# EAGLE design current_sensor (EAGLE 8.3.2)
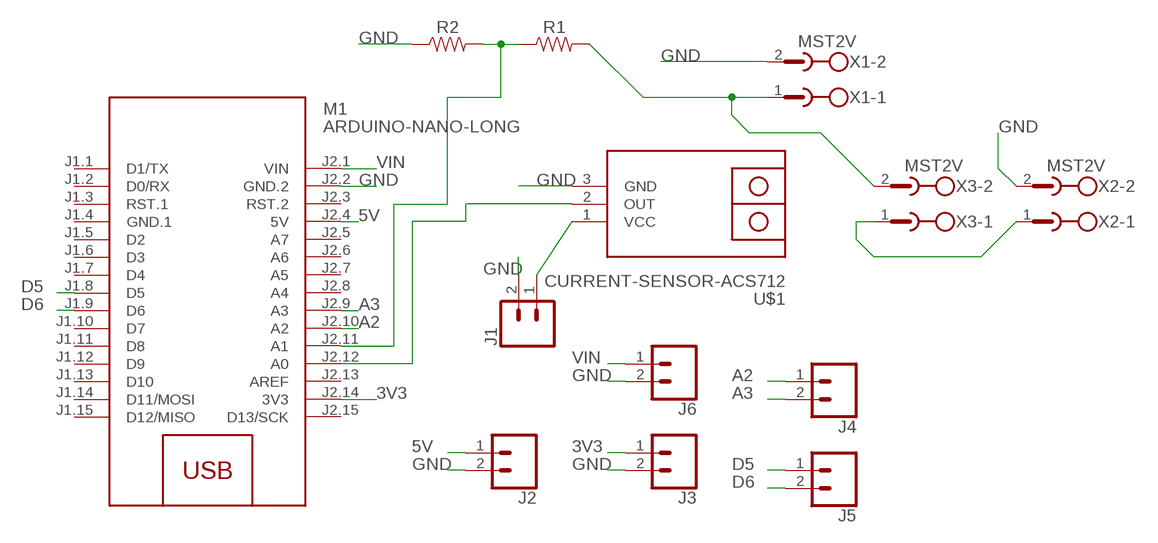
[diagram p0: schematic, sheet 1]

## Parts
J1  CONN_02LOCK_LONGPADS  [1X02_LOCK_LONGPADS]
J2  CONN_02LOCK_LONGPADS  [1X02_LOCK_LONGPADS]
J3  CONN_02LOCK_LONGPADS  [1X02_LOCK_LONGPADS]
J4  CONN_02LOCK_LONGPADS  [1X02_LOCK_LONGPADS]
J5  CONN_02LOCK_LONGPADS  [1X02_LOCK_LONGPADS]
J6  CONN_02LOCK_LONGPADS  [1X02_LOCK_LONGPADS]
M1  ARDUINO-NANO-LONG  [ARDUINO-NANO-LONG]
R1  RESISTORAXIAL-0.3  [AXIAL-0.3]
R2  RESISTORAXIAL-0.3  [AXIAL-0.3]
U$1  CURRENT-SENSOR-ACS712  [CURRENT-SENSOR-ACS712]
X1  MST2V  [MSTBV2]
X2  MST2V  [MSTBV2]
X3  MST2V  [MSTBV2]

## Nets
3V3: J3.1 M1.J2.14(3V3)
5V: J2.1 M1.J2.4(5V)
A2: J4.1 M1.J2.10(A2)
A3: J4.2 M1.J2.9(A3)
D5: J5.1 M1.J1.8(D5)
D6: J5.2 M1.J1.9(D6)
GND: J1.2 J2.2 J3.2 J6.2 M1.J2.2(GND.2) R2.P$1 U$1.3(GND) X1.2 X2.2
N$1: M1.J2.12(A0) U$1.2(OUT)
N$2: R1.P$2 X1.1 X3.2
N$3: J1.1 U$1.1(VCC)
N$5: M1.J2.11(A1) R1.P$1 R2.P$2
N$6: X2.1 X3.1
VIN: J6.1 M1.J2.1(VIN)
Unconnected: M1.J1.1(D1/TX) M1.J1.2(D0/RX) M1.J1.3(RST.1) M1.J1.5(D2) M1.J1.6(D3) M1.J1.7(D4) M1.J1.10(D7) M1.J1.11(D8) M1.J1.12(D9) M1.J1.13(D10) M1.J1.14(D11/MOSI) M1.J1.15(D12/MISO) M1.J2.3(RST.2) M1.J2.5(A7) M1.J2.6(A6) M1.J2.7(A5) M1.J2.8(A4) M1.J2.13(AREF) M1.J2.15(D13/SCK)

## Power pins joined to a net without a drawn wire
GND.1: M1.J1.4(GND.1)

## Library data of the parts
J1-J6 = SparkFun-Connectors:CONN_02: Multi connection point. Often used as Generic Header-pin footprint for 0.1 inch spaced/style header connections On any of the 0.1 inch spaced packages, you can populate with these: Break Away Headers - Straight <https://www.sparkfun.com/products/116> (PRT-00116) Break Away Male Headers - Right Angle <https://www.sparkfun.com/products/553> (PRT-00553) Female Headers <https://www.sparkfun.com/products/115> (PRT-00115) Break Away Headers - Machine Pin <https://www.sparkfun.com/products/117> (PRT-00117) Break Away Female Headers - Swiss Machine Pin <https://www.sparkfun.com/products/743> (PRT-00743) For SCREWTERMINALS and SPRING TERMINALS visit here: Screw Terimnals on SparkFun.com <https://www.sparkfun.com/search/results?term=Screw+Terminals> (5mm/3.5mm/2.54mm spacing) This device is also useful as a general connection point to wire up your design to another part of your project. Our various solder wires solder well into these plated through hole pads. Hook-Up Wire - Assortment (Stranded, 22 AWG) <https://www.sparkfun.com/products/11375> (PRT-11375) Hook-Up Wire - Assortment (Solid Core, 22 AWG) <https://www.sparkfun.com/products/11367> (PRT-11367) View the entire wire category on our website here <https://www.sparkfun.com/categories/141> Special notes: Molex polarized connector foot print use with: PRT-08233 with associated crimp pins and housings. 2.54_SCREWTERM for use with PRT-10571. 3.5mm Screw Terminal footprints for PRT-08084 5mm Screw Terminal footprints for use with PRT-08432
M1 = ArduinoNano:ARDUINO-NANO-LONG: Arduino Nano 3.0 and compatible devices More details available here: https://www.arduino.cc/en/Main/ArduinoBoardNano Click here to find device on ebay.com <http://www.ebay.com/sch/arduino+nano>
R1 R2 = SparkFun-Resistors:RESISTOR: Generic Resistor Package
U$1 = diy-modules:CURRENT-SENSOR-ACS712: Isolated Bipolar Current Sensors based on ACS712 chip More details available here: http://embedded-lab.com/blog/a-brief-overview-of-allegro-acs712-current-sensor-part-1/ Click here to find device on ebay.com <http://www.ebay.com/sch/acs712+module> Note: There are many available versions with different pinout. Please check before use
X1-X3 = con-phoenix-508:MST2V: PHOENIX; OC_FARNELL: unknown; OC_NEWARK: unknown

## Board
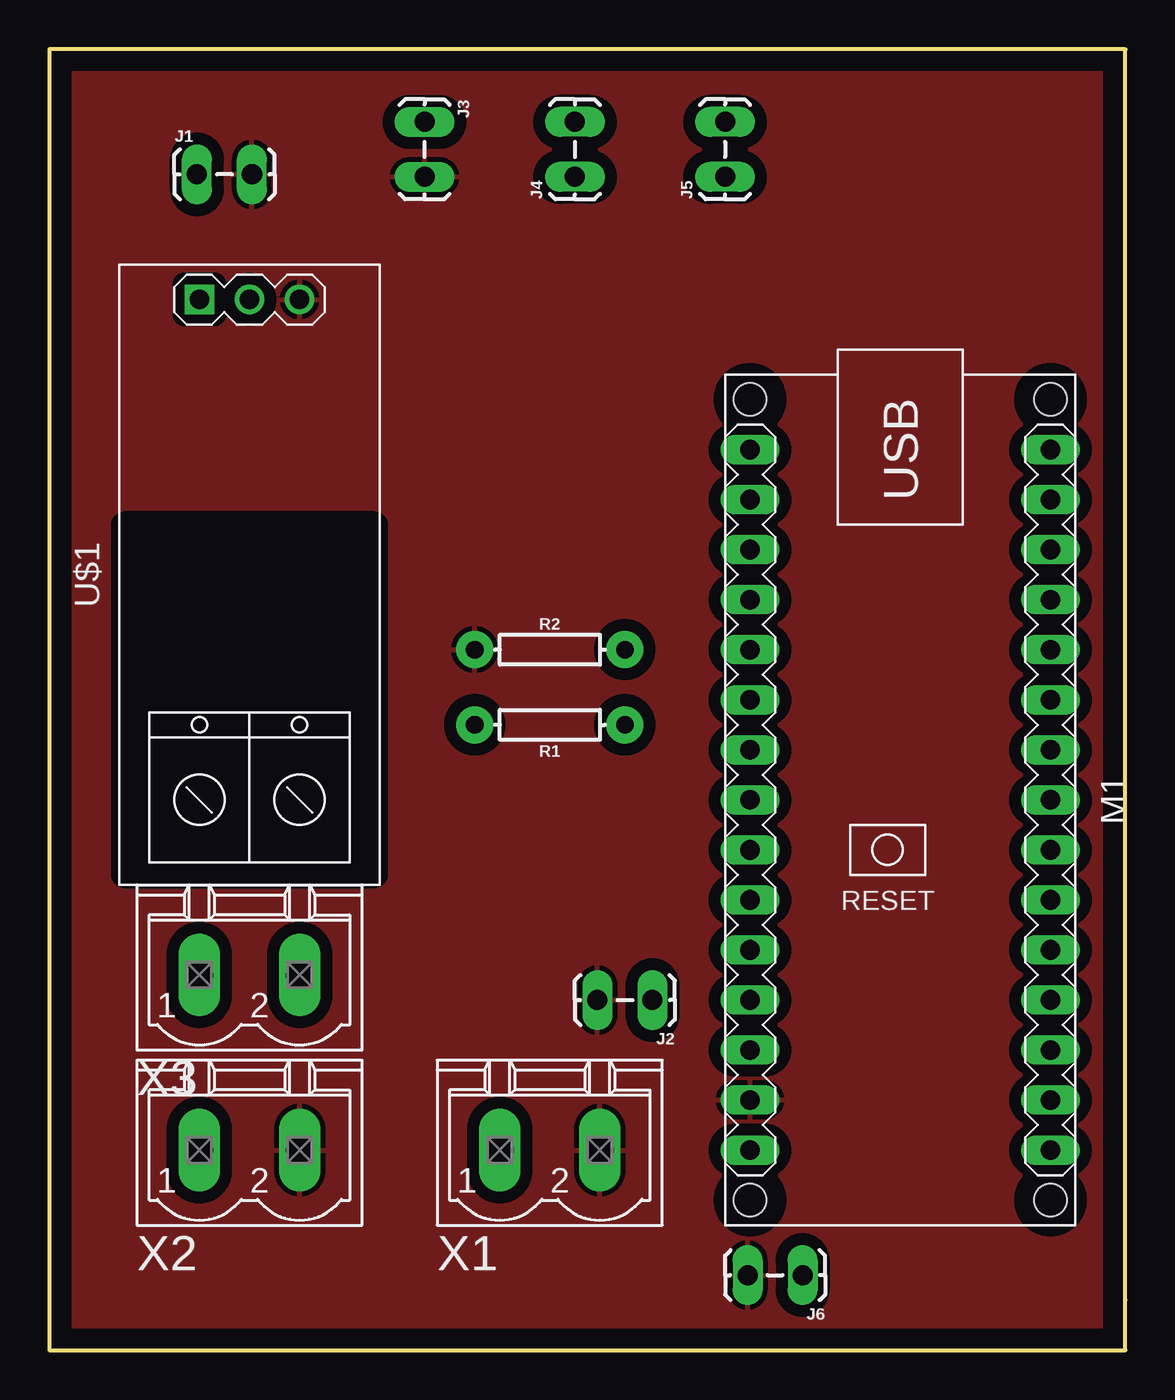
[diagram p1: board, top side]
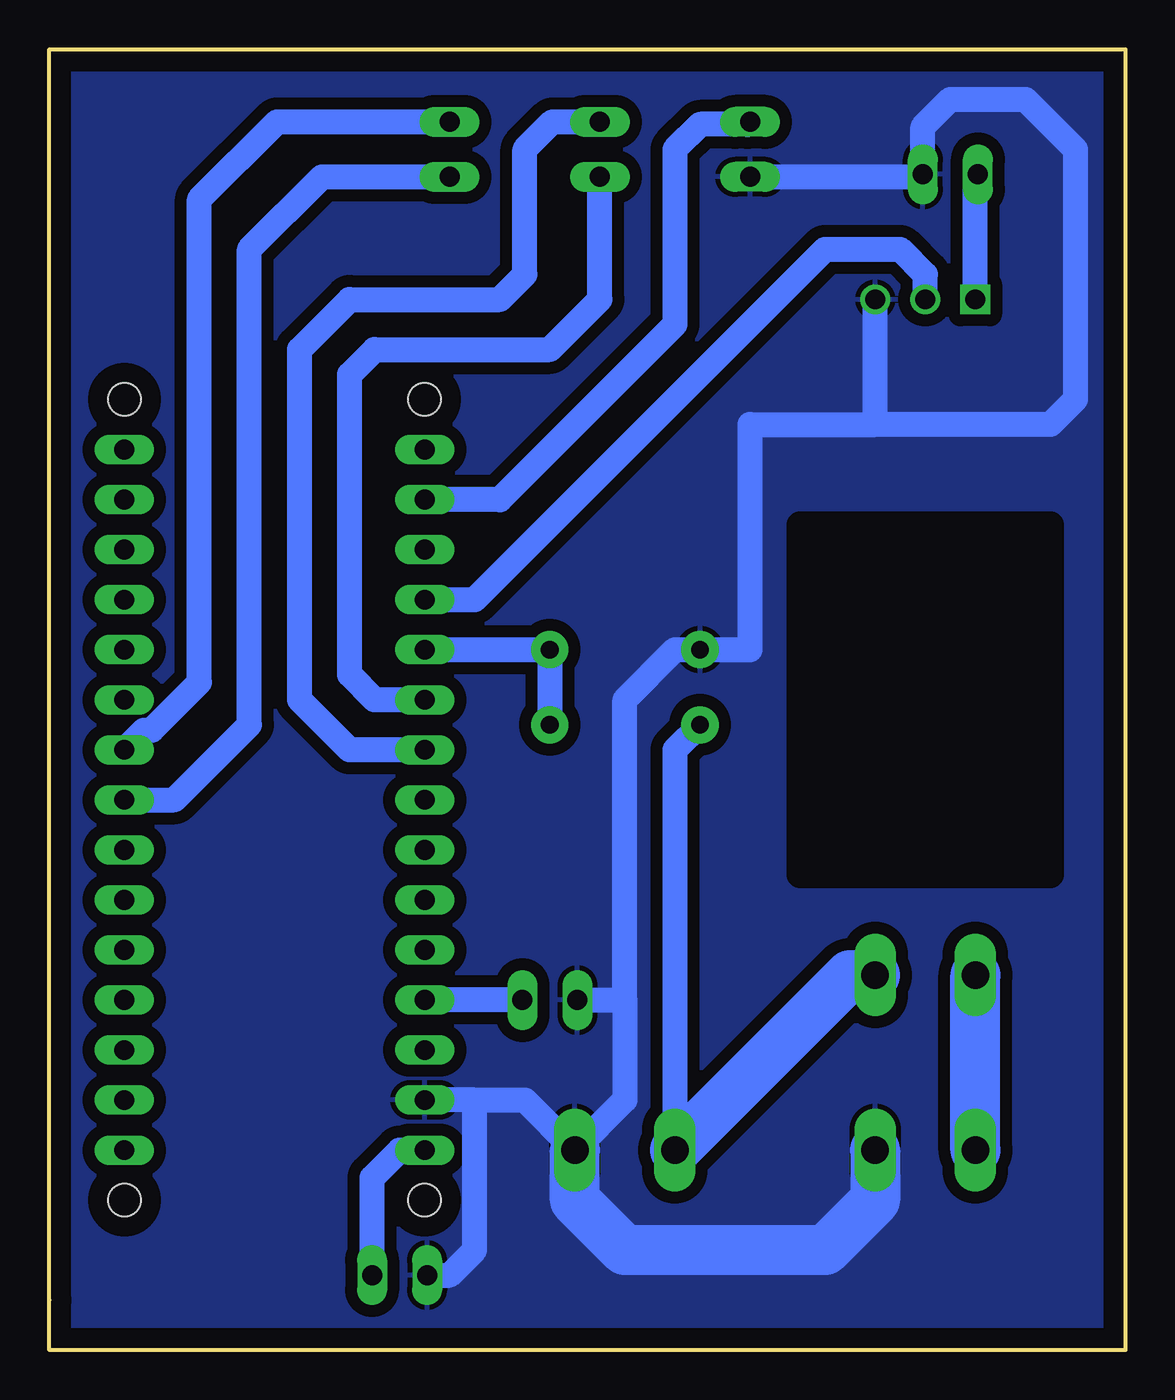
[diagram p2: board, bottom side, seen from below]

Size 54.61 x 66.04 mm. Coordinates in mm from the lower left corner, seen from the top.
Outline: 54.61,2.54 54.61,66.04 0,66.04 0,2.54 0,0 54.61,0 54.61,2.54
Copper layers (1*16): Top 0.035mm / dielectric 1.5mm / Bottom 0.035mm
Design rules "default *": minimum track width 6mil, minimum drill 0.9mm, track to track 6mil, track to pad 6mil, pad to pad 6mil, via to via 6mil, smd to smd 6mil, copper to edge 40mil, drill to drill 6mil, minimum pad ring 10mil, minimum via ring 8mil, stop-mask expansion 4mil, vias tented up to drill 0mil, thermal gap 10mil
tRestrict: area 3.8,24.1 to 16.5,41.9
bRestrict: area 3.8,24.1 to 16.5,41.9

### Footprints (pad centres in the part's own frame; a part is rotated, then mirrored left to right if it is on the bottom)
1X02_LOCK_LONGPADS = drill 1.016 long: 1 -0.127,0; 2 2.667,0
ARDUINO-NANO-LONG = drill 1 long: J1.1 17.78,7.62; J1.2 15.24,7.62; J1.3 12.7,7.62; J1.4 10.16,7.62; J1.5 7.62,7.62; J1.6 5.08,7.62; J1.7 2.54,7.62; J1.8 0,7.62; J1.9 -2.54,7.62; J1.10 -5.08,7.62; J1.11 -7.62,7.62; J1.12 -10.16,7.62; J1.13 -12.7,7.62; J1.14 -15.24,7.62; J1.15 -17.78,7.62; J2.1 17.78,-7.62; J2.2 15.24,-7.62; J2.3 12.7,-7.62; J2.4 10.16,-7.62; J2.5 7.62,-7.62; J2.6 5.08,-7.62; J2.7 2.54,-7.62; J2.8 0,-7.62; J2.9 -2.54,-7.62; J2.10 -5.08,-7.62; J2.11 -7.62,-7.62; J2.12 -10.16,-7.62; J2.13 -12.7,-7.62; J2.14 -15.24,-7.62; J2.15 -17.78,-7.62 | hole 1.651: -20.32,7.62; -20.32,-7.62; 20.32,-7.62; 20.32,7.62
AXIAL-0.3 = drill 0.9 pad 1.88: P$1 -3.81,0; P$2 3.81,0
CURRENT-SENSOR-ACS712 = drill 1 square: 1 13.97,2.54 | drill 1: 2 13.97,0; 3 13.97,-2.54
MSTBV2 = drill 1.397 long: 1 -2.54,0; 2 2.54,0

### Placement (x,y rotation side)
J1  7.62,59.69 0 top
J2  30.48,17.78 180 top
J3  19.05,62.23 270 top
J4  26.67,59.69 90 top
J5  34.29,59.69 90 top
J6  38.1,3.81 180 top
M1  43.18,27.94 270 top
R1  25.4,31.75 180 top
R2  25.4,35.56 0 top
U$1  10.16,39.37 90 top
X1  25.4,10.16 0 top
X2  10.16,10.16 0 top
X3  10.16,19.05 0 top

### Tracks (layer width: path | path; a pad name or v marks a point on that pad's centre or on a via)
3V3
  Bottom 1.27: 19.18,62.23 J3.1 19.18,62.23 | 19.18,62.23 21.59,62.23 22.86,60.96 22.86,52.07 31.75,43.18 M1.J2.14
5V
  Bottom 1.27: J2.1 M1.J2.4
A2
  Bottom 1.27: M1.J2.10 38.1,33.02 39.37,34.29 39.37,49.53 38.1,50.8 29.21,50.8 26.67,53.34 J4.1 | J4.1 26.67,59.69 J4.1
A3
  Bottom 1.27: M1.J2.9 39.37,30.48 41.91,33.02 41.91,50.8 39.37,53.34 31.75,53.34 30.48,54.61 30.48,60.96 29.08,62.36 J4.2
D5
  Bottom 1.27: M1.J1.8 48.26,27.94 44.45,31.75 44.45,55.88 40.77,59.56 J5.1
D6
  Bottom 1.27: M1.J1.9 49.8,31.48 49.41,31.48 46.99,33.9 46.99,58.42 43.05,62.36 J5.2
GND
  Bottom 1.27: 12.7,46.99 U$1.3 | 12.7,46.99 3.81,46.99 2.54,48.26 2.54,60.96 5.08,63.5 8.89,63.5 10.29,62.1 J1.2 10.41,59.56 J3.2 | 12.7,46.99 19.05,46.99 19.05,35.56 R2.P$1 22.86,35.56 25.4,33.02 25.4,17.78 | 33.02,12.7 30.48,12.7 X1.2 25.4,12.7 25.4,17.78 | 33.02,12.7 M1.J2.2 | J2.2 25.4,17.78 | J6.2 34.29,3.81 33.02,5.08 33.02,12.7
  Bottom 2.54: X2.2 12.7,7.62 15.24,5.08 25.4,5.08 27.94,7.62 X1.2
  pour Bottom (isolate 0.61): 0,66.04 53.34,66.04 54.61,66.04
  pour Top (isolate 0.61): 0,0 0,66.04 54.61,66.04 54.61,0
  pour Bottom (isolate 0.61): 0,0 0,66.04 54.61,66.04 54.61,0
N$1
  Bottom 1.27: U$1.2 10.16,54.61 11.43,55.88 15.24,55.88 33.02,38.1 M1.J2.12
N$2
  Bottom 1.27: R1.P$2 22.86,30.48 X1.1
  Bottom 2.54: X1.1 13.97,19.05 X3.2
N$3
  Bottom 1.27: U$1.1 7.62,59.56 J1.1
N$5
  Bottom 1.27: R1.P$1 R2.P$2 M1.J2.11
N$6
  Bottom 2.54: X2.1 X3.1
VIN
  Bottom 1.27: J6.1 38.23,8.76 36.83,10.16 M1.J2.1